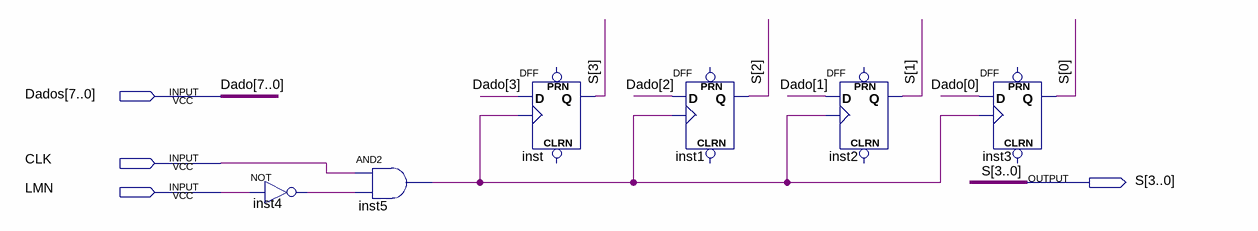
[diagram p0: schematic sheet]
// Quartus schematic REM.bdf as structural Verilog: 6 symbols, 4 pins
module REM (
  input  [7:0] Dados,
  input  CLK,
  input  LMN,
  output [3:0] S
);

  wire inst4_out, inst5_out;

  not inst4 (inst4_out, LMN);
  and inst5 (inst5_out, CLK, inst4_out);
  DFF inst (.CLK(inst5_out), .D(Dados[3]), .Q(S[3]));  // open: CLRN, PRN
  DFF inst1 (.CLK(inst5_out), .D(Dados[2]), .Q(S[2]));  // open: CLRN, PRN
  DFF inst2 (.CLK(inst5_out), .D(Dados[1]), .Q(S[1]));  // open: CLRN, PRN
  DFF inst3 (.CLK(inst5_out), .D(Dados[0]), .Q(S[0]));  // open: CLRN, PRN

  // Other names for the same wires on the sheet: Dado[7:0] = Dados
endmodule
